# Altium schematic sheet Calc_V1.SchDoc
size A3
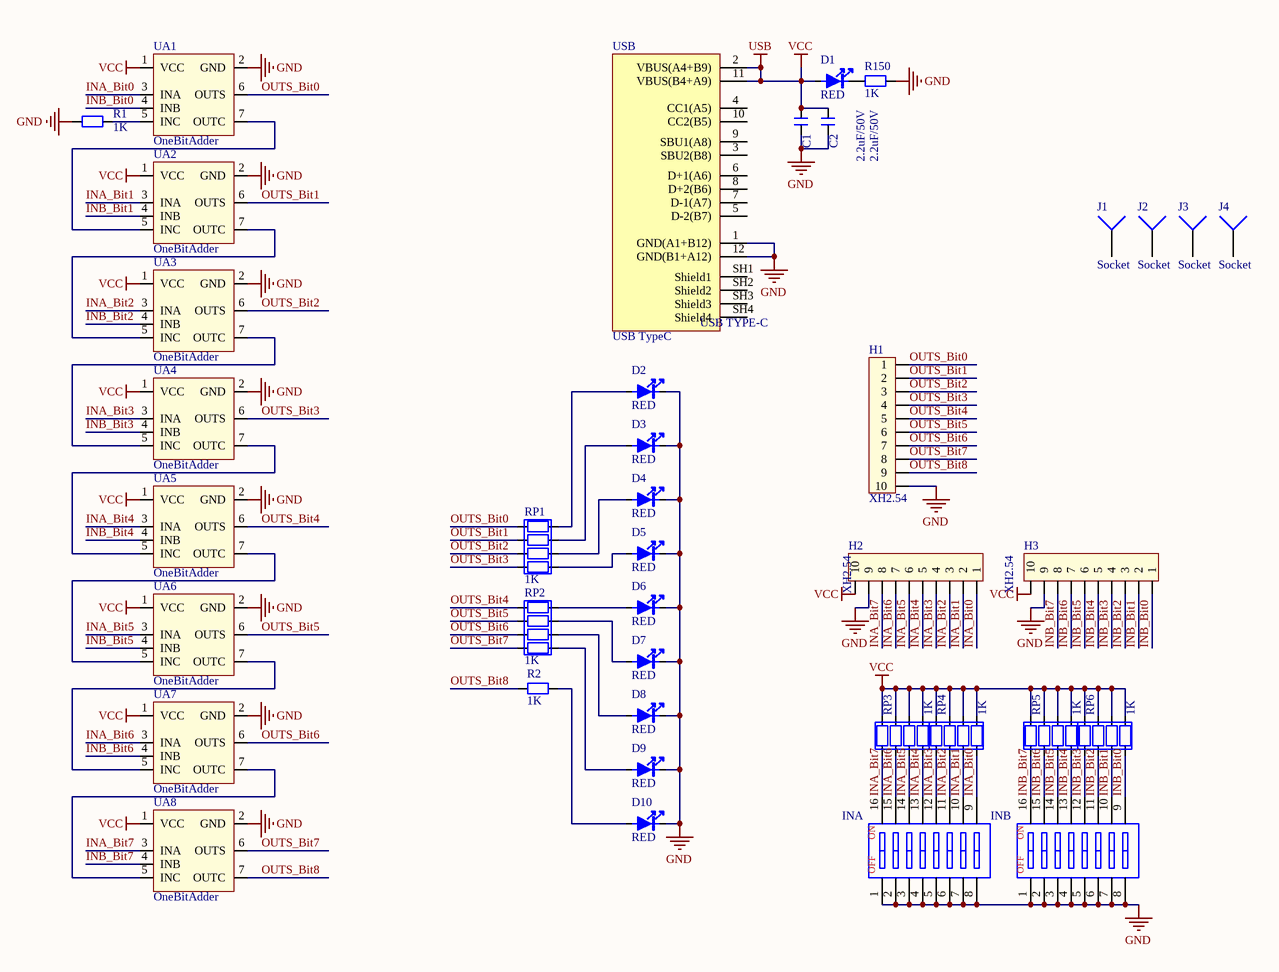
[diagram p0: Calc_V1.SchDoc]

## Parts
C1  2.2uF/50V  [C 0603_L]
C2  2.2uF/50V  [C 0603_L]
D1  RED  [LED 0603B]
D2  RED  [LED 0603B]
D3  RED  [LED 0603B]
D4  RED  [LED 0603B]
D5  RED  [LED 0603B]
D6  RED  [LED 0603B]
D7  RED  [LED 0603B]
D8  RED  [LED 0603B]
D9  RED  [LED 0603B]
D10  RED  [LED 0603B]
H1  XH2.54  [HDR2.54-LI-10P]
H2  XH2.54  [HDR2.54-LI-10P]
H3  XH2.54  [HDR2.54-LI-10P]
INA  CSW-8P  [CSW DIP-8P]  (value not drawn)
INB  CSW-8P  [CSW DIP-8P]  (value not drawn)
J1  Socket  [M3]
J2  Socket  [M3]
J3  Socket  [M3]
J4  Socket  [M3]
R1  1K  [R 0603_L]
R2  1K  [R 0603_L]
R150  1K  [R 0603_L]
RP1  1K  [P_pack]
RP2  1K  [P_pack]
RP3  1K  [P_pack]
RP4  1K  [P_pack]
RP5  1K  [P_pack]
RP6  1K  [P_pack]
UA1  OneBitAdder  [OneBitAdder]
UA2  OneBitAdder  [OneBitAdder]
UA3  OneBitAdder  [OneBitAdder]
UA4  OneBitAdder  [OneBitAdder]
UA5  OneBitAdder  [OneBitAdder]
UA6  OneBitAdder  [OneBitAdder]
UA7  OneBitAdder  [OneBitAdder]
UA8  OneBitAdder  [OneBitAdder]
USB  USB TypeC  [USB Type-C]

## Nets
GND: C1.1 C2.1 D2.2 D3.2 D4.2 D5.2 D6.2 D7.2 D8.2 D9.2 D10.2 H1.10 H2.9 H3.9 INA.1 INA.2 INA.3 INA.4 INA.5 INA.6 INA.7 INA.8 INB.1 INB.2 INB.3 INB.4 INB.5 INB.6 INB.7 INB.8 R1.1 R150.2 UA1.2(GND) UA2.2(GND) UA3.2(GND) UA4.2(GND) UA5.2(GND) UA6.2(GND) UA7.2(GND) UA8.2(GND) USB.1(GND(A1+B12)) USB.12(GND(B1+A12))
USB: C1.2 C2.2 D1.1 H2.10 H3.10 RP3.2 RP3.4 RP3.6 RP3.8 RP4.2 RP4.4 RP4.6 RP4.8 RP5.2 RP5.4 RP5.6 RP5.8 RP6.2 RP6.4 RP6.6 RP6.8 UA1.1(VCC) UA2.1(VCC) UA3.1(VCC) UA4.1(VCC) UA5.1(VCC) UA6.1(VCC) UA7.1(VCC) UA8.1(VCC) USB.2(VBUS(A4+B9)) USB.11(VBUS(B4+A9))  [also labelled VCC]
INA_Bit0: H2.1 INA.9 RP4.7 UA1.3(INA)
INA_Bit1: H2.2 INA.10 RP4.5 UA2.3(INA)
INA_Bit2: H2.3 INA.11 RP4.3 UA3.3(INA)
INA_Bit3: H2.4 INA.12 RP4.1 UA4.3(INA)
INA_Bit4: H2.5 INA.13 RP3.7 UA5.3(INA)
INA_Bit5: H2.6 INA.14 RP3.5 UA6.3(INA)
INA_Bit6: H2.7 INA.15 RP3.3 UA7.3(INA)
INA_Bit7: H2.8 INA.16 RP3.1 UA8.3(INA)
INB_Bit0: H3.1 INB.9 RP6.7 UA1.4(INB)
INB_Bit1: H3.2 INB.10 RP6.5 UA2.4(INB)
INB_Bit2: H3.3 INB.11 RP6.3 UA3.4(INB)
INB_Bit3: H3.4 INB.12 RP6.1 UA4.4(INB)
INB_Bit4: H3.5 INB.13 RP5.7 UA5.4(INB)
INB_Bit5: H3.6 INB.14 RP5.5 UA6.4(INB)
INB_Bit6: H3.7 INB.15 RP5.3 UA7.4(INB)
INB_Bit7: H3.8 INB.16 RP5.1 UA8.4(INB)
OUTS_Bit0: H1.1 RP1.2 UA1.6(OUTS)
OUTS_Bit1: H1.2 RP1.4 UA2.6(OUTS)
OUTS_Bit2: H1.3 RP1.6 UA3.6(OUTS)
OUTS_Bit3: H1.4 RP1.8 UA4.6(OUTS)
OUTS_Bit4: H1.5 RP2.2 UA5.6(OUTS)
OUTS_Bit5: H1.6 RP2.4 UA6.6(OUTS)
OUTS_Bit6: H1.7 RP2.6 UA7.6(OUTS)
OUTS_Bit7: H1.8 RP2.8 UA8.6(OUTS)
OUTS_Bit8: H1.9 R2.1 UA8.7(OUTC)
NetD1_2: D1.2 R150.1
NetD2_1: D2.1 RP1.1
NetD3_1: D3.1 RP1.3
NetD4_1: D4.1 RP1.5
NetD5_1: D5.1 RP1.7
NetD6_1: D6.1 RP2.1
NetD7_1: D7.1 RP2.3
NetD8_1: D8.1 RP2.5
NetD9_1: D9.1 RP2.7
NetD10_1: D10.1 R2.2
NetR1_2: R1.2 UA1.5(INC)
NetUA1_7: UA1.7(OUTC) UA2.5(INC)
NetUA2_7: UA2.7(OUTC) UA3.5(INC)
NetUA3_7: UA3.7(OUTC) UA4.5(INC)
NetUA4_7: UA4.7(OUTC) UA5.5(INC)
NetUA5_7: UA5.7(OUTC) UA6.5(INC)
NetUA6_7: UA6.7(OUTC) UA7.5(INC)
NetUA7_7: UA7.7(OUTC) UA8.5(INC)

Not connected (* = marked no-connect by the designer): J1 1; J2 1; J3 1; J4 1; USB 3(SBU2(B8)) 4(CC1(A5)) 5(D-2(B7)) 6(D+1(A6)) 7(D-1(A7)) 8(D+2(B6)) 9(SBU1(A8)) 10(CC2(B5)) SH1(Shield1) SH2(Shield2) SH3(Shield3) SH4(Shield4)

## Notes on the sheet
- (in symbol CSW-8P) ON; OFF
- (in symbol USB 2.0 Type C) USB TYPE-C

## Library data of the parts
C1 C2 = C: 无极性贴片电容; BOM名称: 无极性贴片电容
D1-D10 = LED: 发光二极管
H1-H3 = Header_10P: 端子
INA INB = CSW-8P: 8路编码开关; BOM名称: 8路编码开关
R1 R2 R150 = R: 贴片电阻
RP1-RP6 = R_pack: 贴片排阻
UA1-UA8 = OneBitAdder: 一位全加法器
USB = USB 2.0 Type C: 12P TypeC 母座; 版权归属: 正点原子; Parameter: 接口器件; 学习资源: www.openedv.com
J1-J4 = Socket: LatestRevisionDate: 17-Jul-2002; LatestRevisionNote: Re-released for DXP Platform.; Publisher: Altium Limited